# Altium schematic sheet NNP-DWG-165-001-000 BP2 System Pg 2 of 6.SchDoc
size 431 x 279 mm; Organization: ORGANIZATION; Address1: ADDRESS 1; Address2: ADDRESS 2; Address3: ADDRESS 3; Address4: ADDRESS 4; Revision: -; SheetNumber: 2; SheetTotal: 6; ENG_APP_DATE: --/--/--; DSN_APP_DATE: --/--/--; CHK_APP_DATE: --/--/--
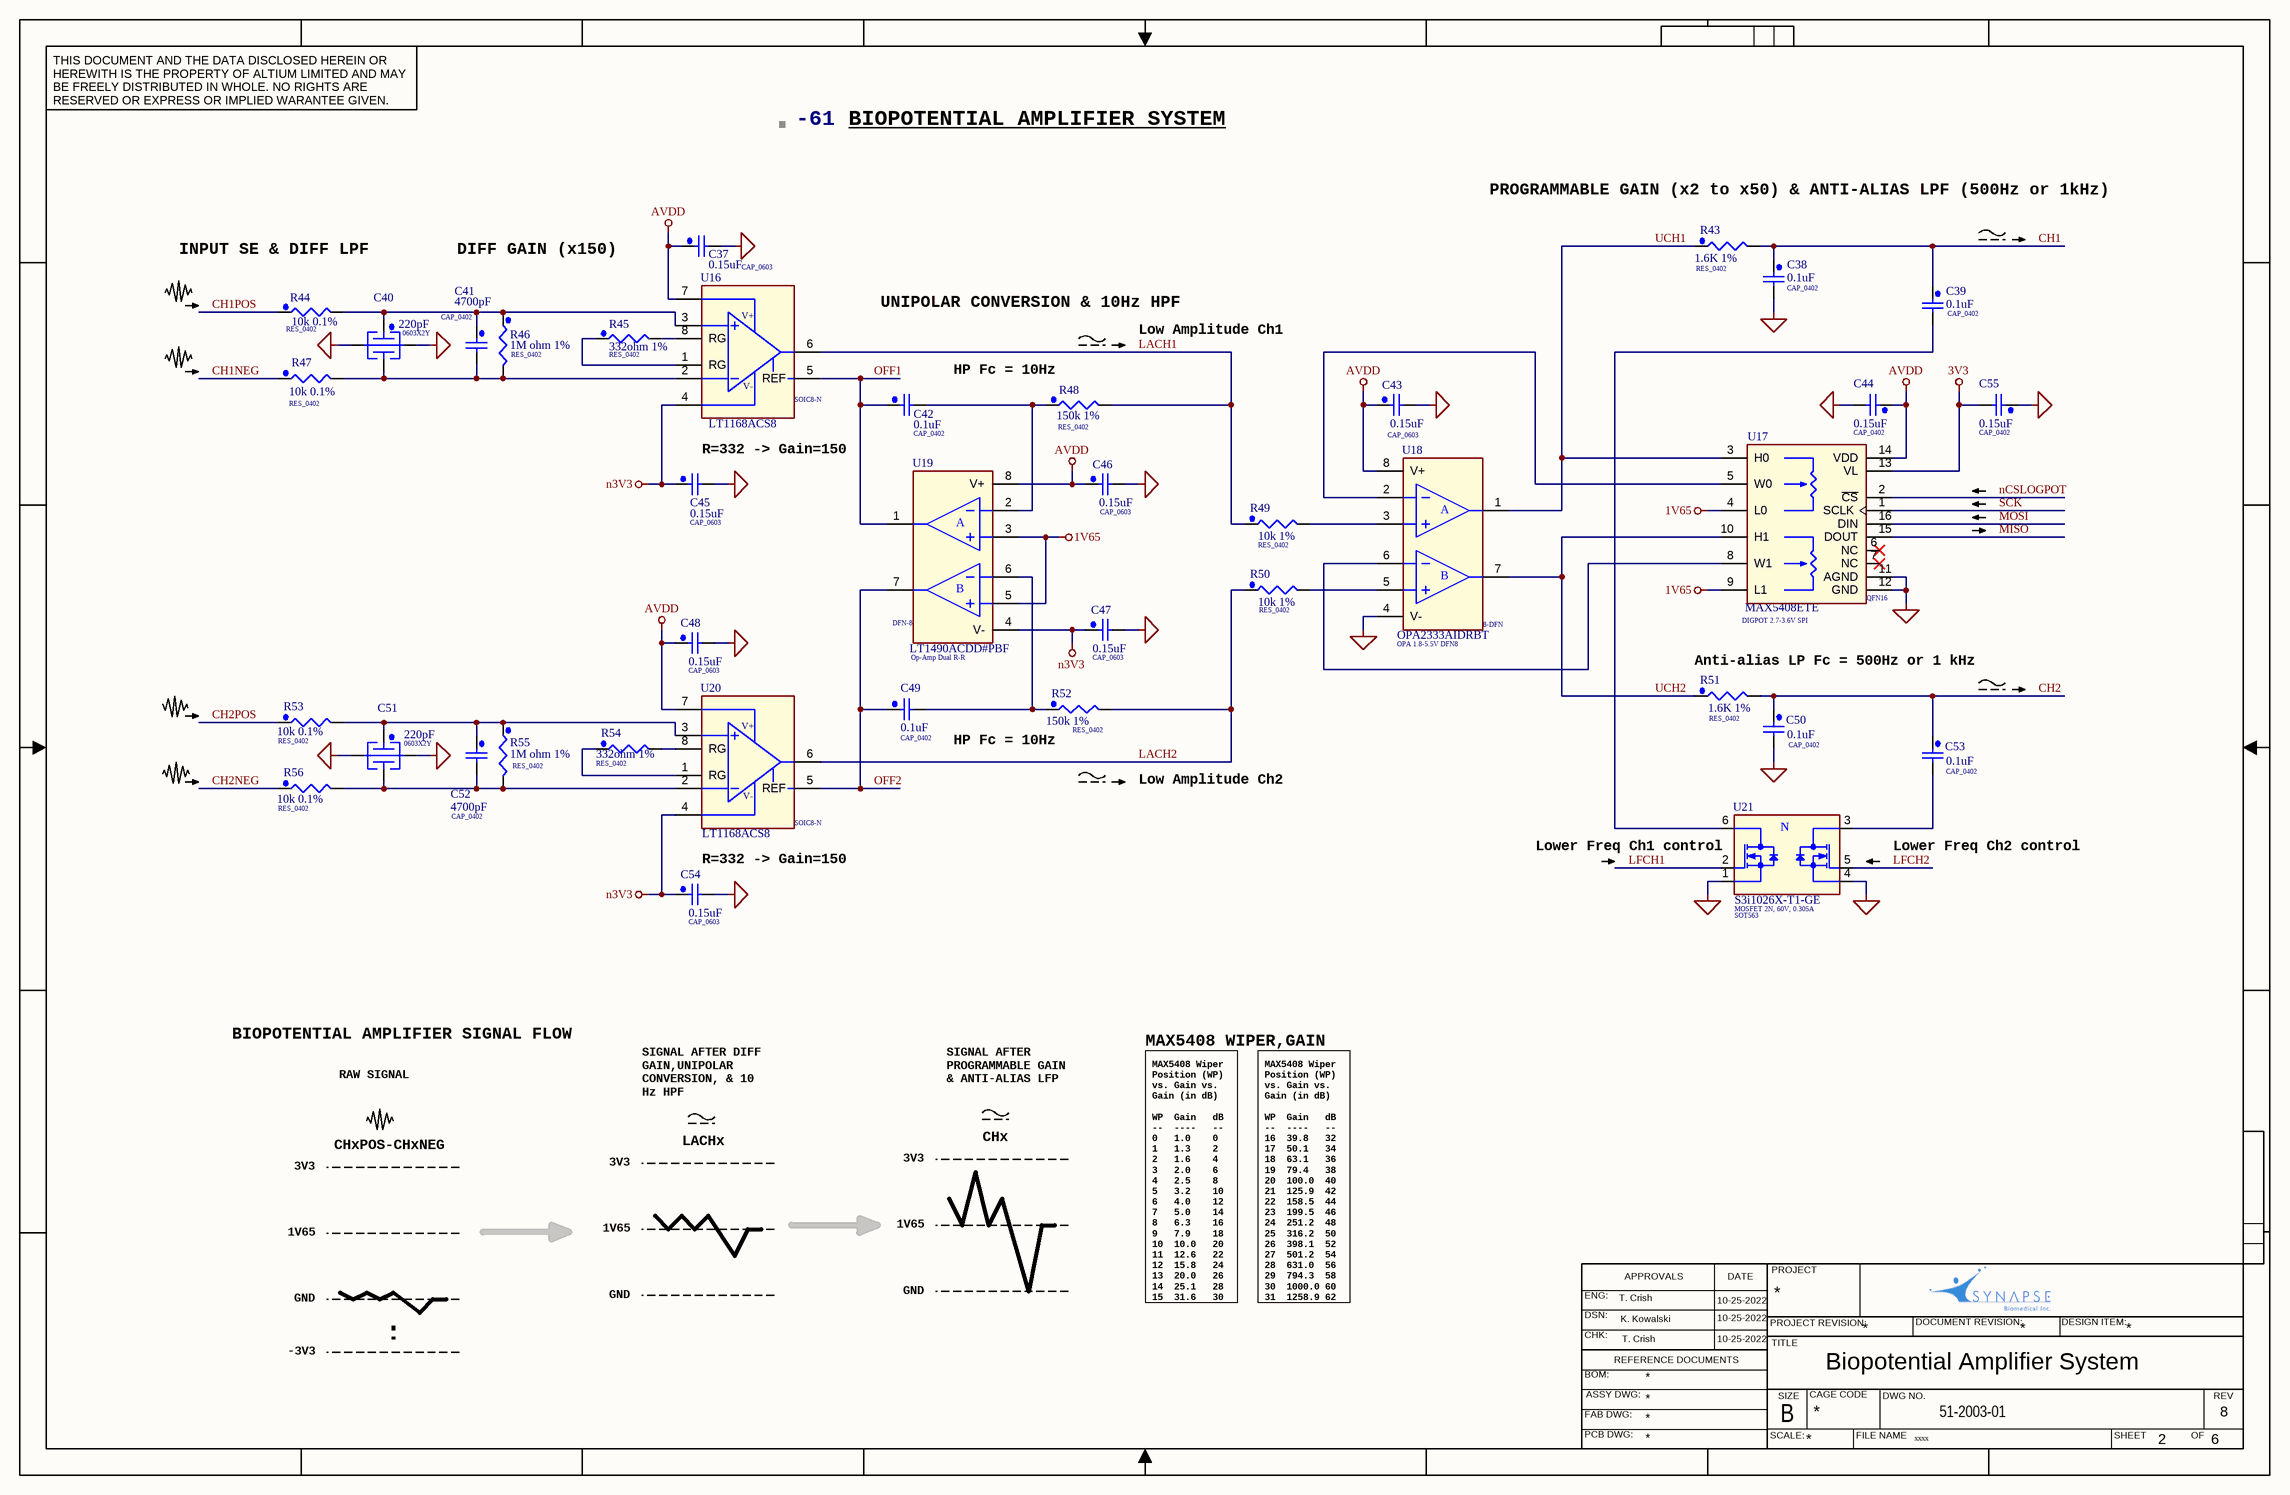
[diagram p0: NNP-DWG-165-001-000 BP2 System Pg 2 of 6.SchDoc]

## Parts
-61  XDESCRIPTION: BIOPOTENTIAL AMPLIFIER SYSTEM  (hidden comment: BOM_S1)  (graphical)
C37  value 0.15uF  [CAP_0603]  (hidden comment: C_150n_X7R_16_0603_10%)
C38  value 0.1uF  [CAP_0402]  (hidden comment: C_100n_X7R_16_0402_10%)
C39  value 0.1uF  [CAP_0402]  (hidden comment: C_100n_X7R_16_0402_10%)
C40  value 220pF  PackageDescription: 0603X2Y  [CAP_0603_X14]  (hidden comment: C_220pF_X7R_50_0603_20%_X2Y)
C41  value 4700pF  [CAP_0402]  (hidden comment: C_4n7_C0G_50_0402_10%)
C42  value 0.1uF  [CAP_0402]  (hidden comment: C_100n_X7R_16_0402_10%)
C43  value 0.15uF  [CAP_0603]  (hidden comment: C_150n_X7R_16_0603_10%)
C44  value 0.15uF  [CAP_0402]  (hidden comment: C_150n_X7R_16_0402_10%)
C45  value 0.15uF  [CAP_0603]  (hidden comment: C_150n_X7R_16_0603_10%)
C46  value 0.15uF  [CAP_0603]  (hidden comment: C_150n_X7R_16_0603_10%)
C47  value 0.15uF  [CAP_0603]  (hidden comment: C_150n_X7R_16_0603_10%)
C48  value 0.15uF  [CAP_0603]  (hidden comment: C_150n_X7R_16_0603_10%)
C49  value 0.1uF  [CAP_0402]  (hidden comment: C_100n_X7R_16_0402_10%)
C50  value 0.1uF  [CAP_0402]  (hidden comment: C_100n_X7R_16_0402_10%)
C51  value 220pF  PackageDescription: 0603X2Y  [CAP_0603_X14]  (hidden comment: C_220pF_X7R_50_0603_20%_X2Y)
C52  value 4700pF  [CAP_0402]  (hidden comment: C_4n7_C0G_50_0402_10%)
C53  value 0.1uF  [CAP_0402]  (hidden comment: C_100n_X7R_16_0402_10%)
C54  value 0.15uF  [CAP_0603]  (hidden comment: C_150n_X7R_16_0603_10%)
C55  value 0.15uF  [CAP_0402]  (hidden comment: C_150n_X7R_16_0402_10%)
R43  value 1.6K 1%  [RES_0402]  (hidden comment: R_1k6_0402)
R44  value 10k 0.1%  [RES_0402]  (hidden comment: R_10k_0402_0%1)
R45  value 332ohm 1%  [RES_0402]  (hidden comment: R_332_0402)
R46  value 1M ohm 1%  [RES_0402]  (hidden comment: RES_0402)
R47  value 10k 0.1%  [RES_0402]  (hidden comment: R_10k_0402_0%1)
R48  value 150k 1%  [RES_0402]  (hidden comment: R_150k_0402)
R49  value 10k 1%  [RES_0402]  (hidden comment: R_10k_0402)
R50  value 10k 1%  [RES_0402]  (hidden comment: R_10k_0402)
R51  value 1.6K 1%  [RES_0402]  (hidden comment: R_1k6_0402)
R52  value 150k 1%  [RES_0402]  (hidden comment: R_150k_0402)
R53  value 10k 0.1%  [RES_0402]  (hidden comment: R_10k_0402_0%1)
R54  value 332ohm 1%  [RES_0402]  (hidden comment: R_332_0402)
R55  value 1M ohm 1%  [RES_0402]  (hidden comment: RES_0402)
R56  value 10k 0.1%  [RES_0402]  (hidden comment: R_10k_0402_0%1)
U16  INA 2.3-18V 530uA  [SOIC8-N]  (value not drawn)
U17  DIGPOT 2.7-3.6V SPI  [QFN16]
U18  OPA 1.8-5.5V DFN8  PackageDescription: 8-DFN  [TI-DRB8-2400X1650TP_V]
U19  Op-Amp Dual R-R  PackageDescription: DFN-8  MPN: LT1490ACDD#PBF  [DFN8]
U20  INA 2.3-18V 530uA  [SOIC8-N]  (value not drawn)
U21  MOSFET 2N, 60V, 0.305A  PackageDescription: SOT563  MPN: S3i1026X-T1-GE  [SOT-563]

## Nets
1V65: U17.4(L0) U17.9(L1) U19.3(+IN_A) U19.5(+IN_B)
3V3: C55.2 U17.13(VL)
AVDD: C37.1 C43.1 C44.1 C46.1 C48.1 U16.7(+VS) U17.14(VDD) U18.8(V+) U19.8(V+) U20.7(+VS)
GND: C37.2 C38.2 C40.3(G1) C40.4(G2) C43.2 C44.2 C45.2 C46.2 C47.2 C48.2 C50.2 C51.3(G1) C51.4(G2) C54.2 C55.1 U17.11(AGND) U17.12(GND) U18.4(V-) U21.1(S1) U21.4(S2)
n3V3: C45.1 C47.1 C54.1 U16.4(-VS) U19.4(V-) U20.4(-VS)
CH1: C38.1 C39.1 R43.2
CH1NEG: R47.1
CH1POS: R44.1
CH2: C50.1 C53.1 R51.2
CH2NEG: R56.1
CH2POS: R53.1
LACH1: R48.2 R49.1 U16.6(OUT)
LACH2: R50.1 R52.2 U20.6(OUT)
LFCH1: U21.2(G1)
LFCH2: U21.5(G2)
MISO: U17.15(DOUT)
MOSI: U17.16(DIN)
nCSLOGPOT: U17.2(~{CS})
OFF1: C42.1 U16.5(REF) U19.1(OUT_A)
OFF2: C49.1 U19.7(OUT_B) U20.5(REF)
SCK: U17.1(SCLK)
UCH1: R43.1 U17.3(H0) U18.1(OUT_A)
UCH2: R51.1 U17.10(H1) U18.7(OUT_B)
NetC39_2: C39.2 U21.6(D1)
NetC40_1: C40.1(A) C41.1 R44.2 R46.1 U16.3(+IN)
NetC40_2: C40.2(B) C41.2 R46.2 R47.2 U16.2(-IN)
NetC42_2: C42.2 R48.1 U19.2(-IN_A)
NetC49_2: C49.2 R52.1 U19.6(-IN_B)
NetC51_1: C51.1(A) C52.1 R53.2 R55.1 U20.3(+IN)
NetC51_2: C51.2(B) C52.2 R55.2 R56.2 U20.2(-IN)
NetC53_2: C53.2 U21.3(D2)
NetR45_1: R45.1 U16.1(RG)
NetR45_2: R45.2 U16.8(RG)
NetR49_2: R49.2 U18.3(+IN_A)
NetR50_2: R50.2 U18.5(+IN_B)
NetR54_1: R54.1 U20.1(RG)
NetR54_2: R54.2 U20.8(RG)
NetU17_5: U17.5(W0) U18.2(-IN_A)
NetU17_8: U17.8(W1) U18.6(-IN_B)

Not connected (* = marked no-connect by the designer): U17 6(NC)* 7(NC)*

## Notes on the sheet
- THIS DOCUMENT AND THE DATA DISCLOSED HEREIN OR HEREWITH IS THE PROPERTY OF ALTIUM LIMITED AND MAY BE FREELY DISTRIBUTED IN WHOLE. NO RIGHTS ARE RESERVED OR EXPRESS OR IMPLIED WARANTEE GIVEN.
- PROGRAMMABLE GAIN (x2 to x50) & ANTI-ALIAS LPF (500Hz or 1kHz)
- INPUT SE & DIFF LPF
- DIFF GAIN (x150)
- UNIPOLAR CONVERSION & 10Hz HPF
- HP Fc = 10Hz
- Low Amplitude Ch1
- R=332 -> Gain=150
- (near R51) Anti-alias LP Fc = 500Hz or 1 kHz
- Low Amplitude Ch2
- (near U21) Lower Freq Ch1 control
- Lower Freq Ch2 control
- BIOPOTENTIAL AMPLIFIER SIGNAL FLOW
- RAW SIGNAL
- SIGNAL AFTER DIFF GAIN,UNIPOLAR CONVERSION, & 10 Hz HPF
- SIGNAL AFTER PROGRAMMABLE GAIN & ANTI-ALIAS LFP
- MAX5408 WIPER,GAIN
- 3V3
- CHxPOS-CHxNEG
- LACHx
- CHx
- 1V65
- GND
- MAX5408 Wiper Position (WP) vs. Gain vs. Gain (in dB)
  WP  Gain   dB
  --  ----   --
  0   1.0    0
  1   1.3    2
  2   1.6    4
  3   2.0    6
  4   2.5    8
  5   3.2    10
  6   4.0    12
  7   5.0    14
  8   6.3    16
  9   7.9    18
  10  10.0   20
  11  12.6   22
  12  15.8   24
  13  20.0   26
  14  25.1   28
  15  31.6   30
- MAX5408 Wiper Position (WP) vs. Gain vs. Gain (in dB)
  WP  Gain   dB
  --  ----   --
  16  39.8   32
  17  50.1   34
  18  63.1   36
  19  79.4   38
  20  100.0  40
  21  125.9  42
  22  158.5  44
  23  199.5  46
  24  251.2  48
  25  316.2  50
  26  398.1  52
  27  501.2  54
  28  631.0  56
  29  794.3  58
  30  1000.0 60
  31  1258.9 62
- ENG:
- T. Crish
- APPROVALS
- 10-25-2022
- DATE
- PROJECT
- -3V3
- DSN:
- CHK:
- REFERENCE DOCUMENTS
- K. Kowalski
- PROJECT REVISION:
- TITLE
- *
- DOCUMENT REVISION:
- Biopotential Amplifier System
- DESIGN ITEM:
- BOM:
- FAB DWG:
- PCB DWG:
- ASSY DWG:
- SCALE:
- SIZE
- B
- CAGE CODE
- FILE NAME
- DWG NO.
- 51-2003-01
- SHEET
- OF
- REV
- 8
- xxxx
- 2
- 6
- (in symbol LT1168ACS8) V+; V-
- (in symbol LT1490ACDD) A; B
- (in symbol OPA2333AIDRBT) A; B
- (in symbol Si1026X-T1-E3) N

## Library data of the parts
-61 = BOM_S1: BOM item small graphic
C37 C43 C45-C48 C54 = GRM188R71C154KA01D: 0.15uF, 16V, X7R, 10%, 0603, RoHS; MFR: Samsung Corp; MPN: CL05B154KO5NNNC; SBI: 53-0070; PackageDescription: CAP_0603; Supplier 1: Digi-Key; Supplier Part Number 1: 490-5955-6-ND
C38 C39 C42 C49 C50 C53 = GRM155R71C104KA88D: 0.1uF, 16V, X7R, 0402, RoHS; MFR: Murata Electronics North America; SBI: 53-0040; PackageDescription: CAP_0402; Supplier 1: Digi-Key; Supplier Part Number 1: 490-3261-6-ND; MPN: GRM155R71C104KA88D
C40 C51 = 500X14W103MV4T: X2Y, 220pF, 50V, X7R, 0603, 20%, RoHS; MFR: Johanson Dielectrics Inc; MPN: 500X14W221MV4T; Supplier 1: Digi-Key; Supplier Part Number 1: 709-1008-1-ND
C41 C52 = C0402C472K5RACTU: 4700pF, 50V, C0G, 0402_10%, RoHS; MFR: Murata Electronics North America; MPN: GRM155R71H472KA01D; SBI: 53-0072; PackageDescription: CAP_0402; Supplier 1: Digi-Key; Supplier Part Number 1: 490-1308-1-ND
C44 C55 = GRM188R71C154KA01D: 0.15uF, 16V, X7R, 10%, 0402, RoHS; MFR: Murata Electronics North America; MPN: GRM155R71C154KA12D; SBI: 53-0040-2; PackageDescription: CAP_0402; Supplier 1: Digi-Key; Supplier Part Number 1: 490-5955-6-ND
R43 R51 = CRCW04021K60FKED: 1.6K ohm, 1%, 1/16W, smd, 0402, RoHS; MFR: Vishay Dale; SBI: 53-0049-10; PackageDescription: RES_0402; Supplier 1: Digi-Key; Supplier Part Number 1: 541-1.60KLCT-ND; MPN: CRCW04021K60FKED
R44 R47 R53 R56 = RG1005P-103-B-T5: 10k ohm, 0.1%, 1/16W, 0402, RoHS; MFR: Vishay Dale; SBI: 53-0073; PackageDescription: RES_0402; Supplier 1: Digi-Key; Supplier Part Number 1: TNP10.0KDACT-ND; MPN: TNPW040210K0BEED
R45 R54 = MCR01MZPF3320: 332 ohm, 1%, 1/16W, 0402, RoHS; MFR: Vishay Dale; SBI: 53-0049-19; PackageDescription: RES_0402; Supplier 1: Digi-Key; Supplier Part Number 1: 541-332LCT-ND; MPN: CRCW0402332RFKED
R46 R55 = MCR01MZPF1004: 1M ohm, 1%, 1/16W, 0402, RoHS; MFR: Vishay Dale; SBI: 53-0049-20; PackageDescription: RES_0402; Supplier 1: Digi-Key; Supplier Part Number 1: 541-1.00MLCT-ND; MPN: CRCW04021M00FKED
R48 R52 = MCR01MZPF1503: 150k ohm, 1%, 1/16W, smd, 0402, RoHS; MFR: Vishay Dale; SBI: 53-0049-11; PackageDescription: RES_0402; Supplier 1: Digi-Key; Supplier Part Number 1: 541-150KLCT-Nd; MPN: CRCW0402150KFKED
R49 R50 = MCR01MZPF1002: 10.0k ohm, 1%, 1/16W, smd, 0402, RoHS; MFR: Vishay Dale; MPN: CRCW040210K0FKED; SBI: 53-0049-8; PackageDescription: RES_0402; Supplier 1: Digi-Key; Supplier Part Number 1: 541-10.0KLCT-ND
U16 U20 = LT1168ACS8: Op-Amp Instrumentation, 400kHz, SOIC8-N, RoHS; MFR: Linear Technology; SBI: 54-0081; PackageDescription: SOIC8-N; Note: 54-0081; MPN: LT1168ACS8; Supplier 1: Digi-Key
  U16: Supplier Part Number 1: LT1168ACS8#PBF-ND
  U20: Supplier Part Number 1: LT1168ACS8#TRPBF-ND
U17 = MAX5408ETE: Digipot, 2.7-3.6V,  SPI, QFN16, RoHS; MFR: Maxim; SBI: 54-0082; PackageDescription: QFN16; MPN: MAX5408ETE; Supplier 1: Digi-Key; Supplier Part Number 1: MAX5408ETE+T-ND
U18 = OPA2333AIDRBT: OPA, 1.8-5.5V, DFN8, RoHS; MFR: Texas Instruments; SBI: 54-0080; Supplier 1: Digi-Key; Supplier Part Number 1: 296-19544-1-ND; MPN: OPA2333AIDRBT
U19 = LT1490ACDD: Op-Amp, Dual, R-R, DFN8, RoHS; MFR: Linear Technology; SBI: 54-0083; ComponentLink1URL: Q:\00\03\00-03-0000 Linear Technology LT1490A.pdf; Supplier 1: Digi-Key; Supplier Part Number 1: LT1490ACDD#PBF-ND
U21 = Si1026X-T1-E3: MOSFET 2N, 60V, 0.305A, RoHS; MFR: Vishay; Value: 500mA; SBI: 54-0066; Supplier 1: Digi-Key; Supplier Part Number 1: SI1026X-T1-GE3TR-ND